# EasyEDA schematic SCH.json
TITLE: Project Sentinel; REV: 1.0; Date: 2025-03-24; Sheet: 1/1; Drawn By: Napat Minual; Company: Vetra, Manta Ray
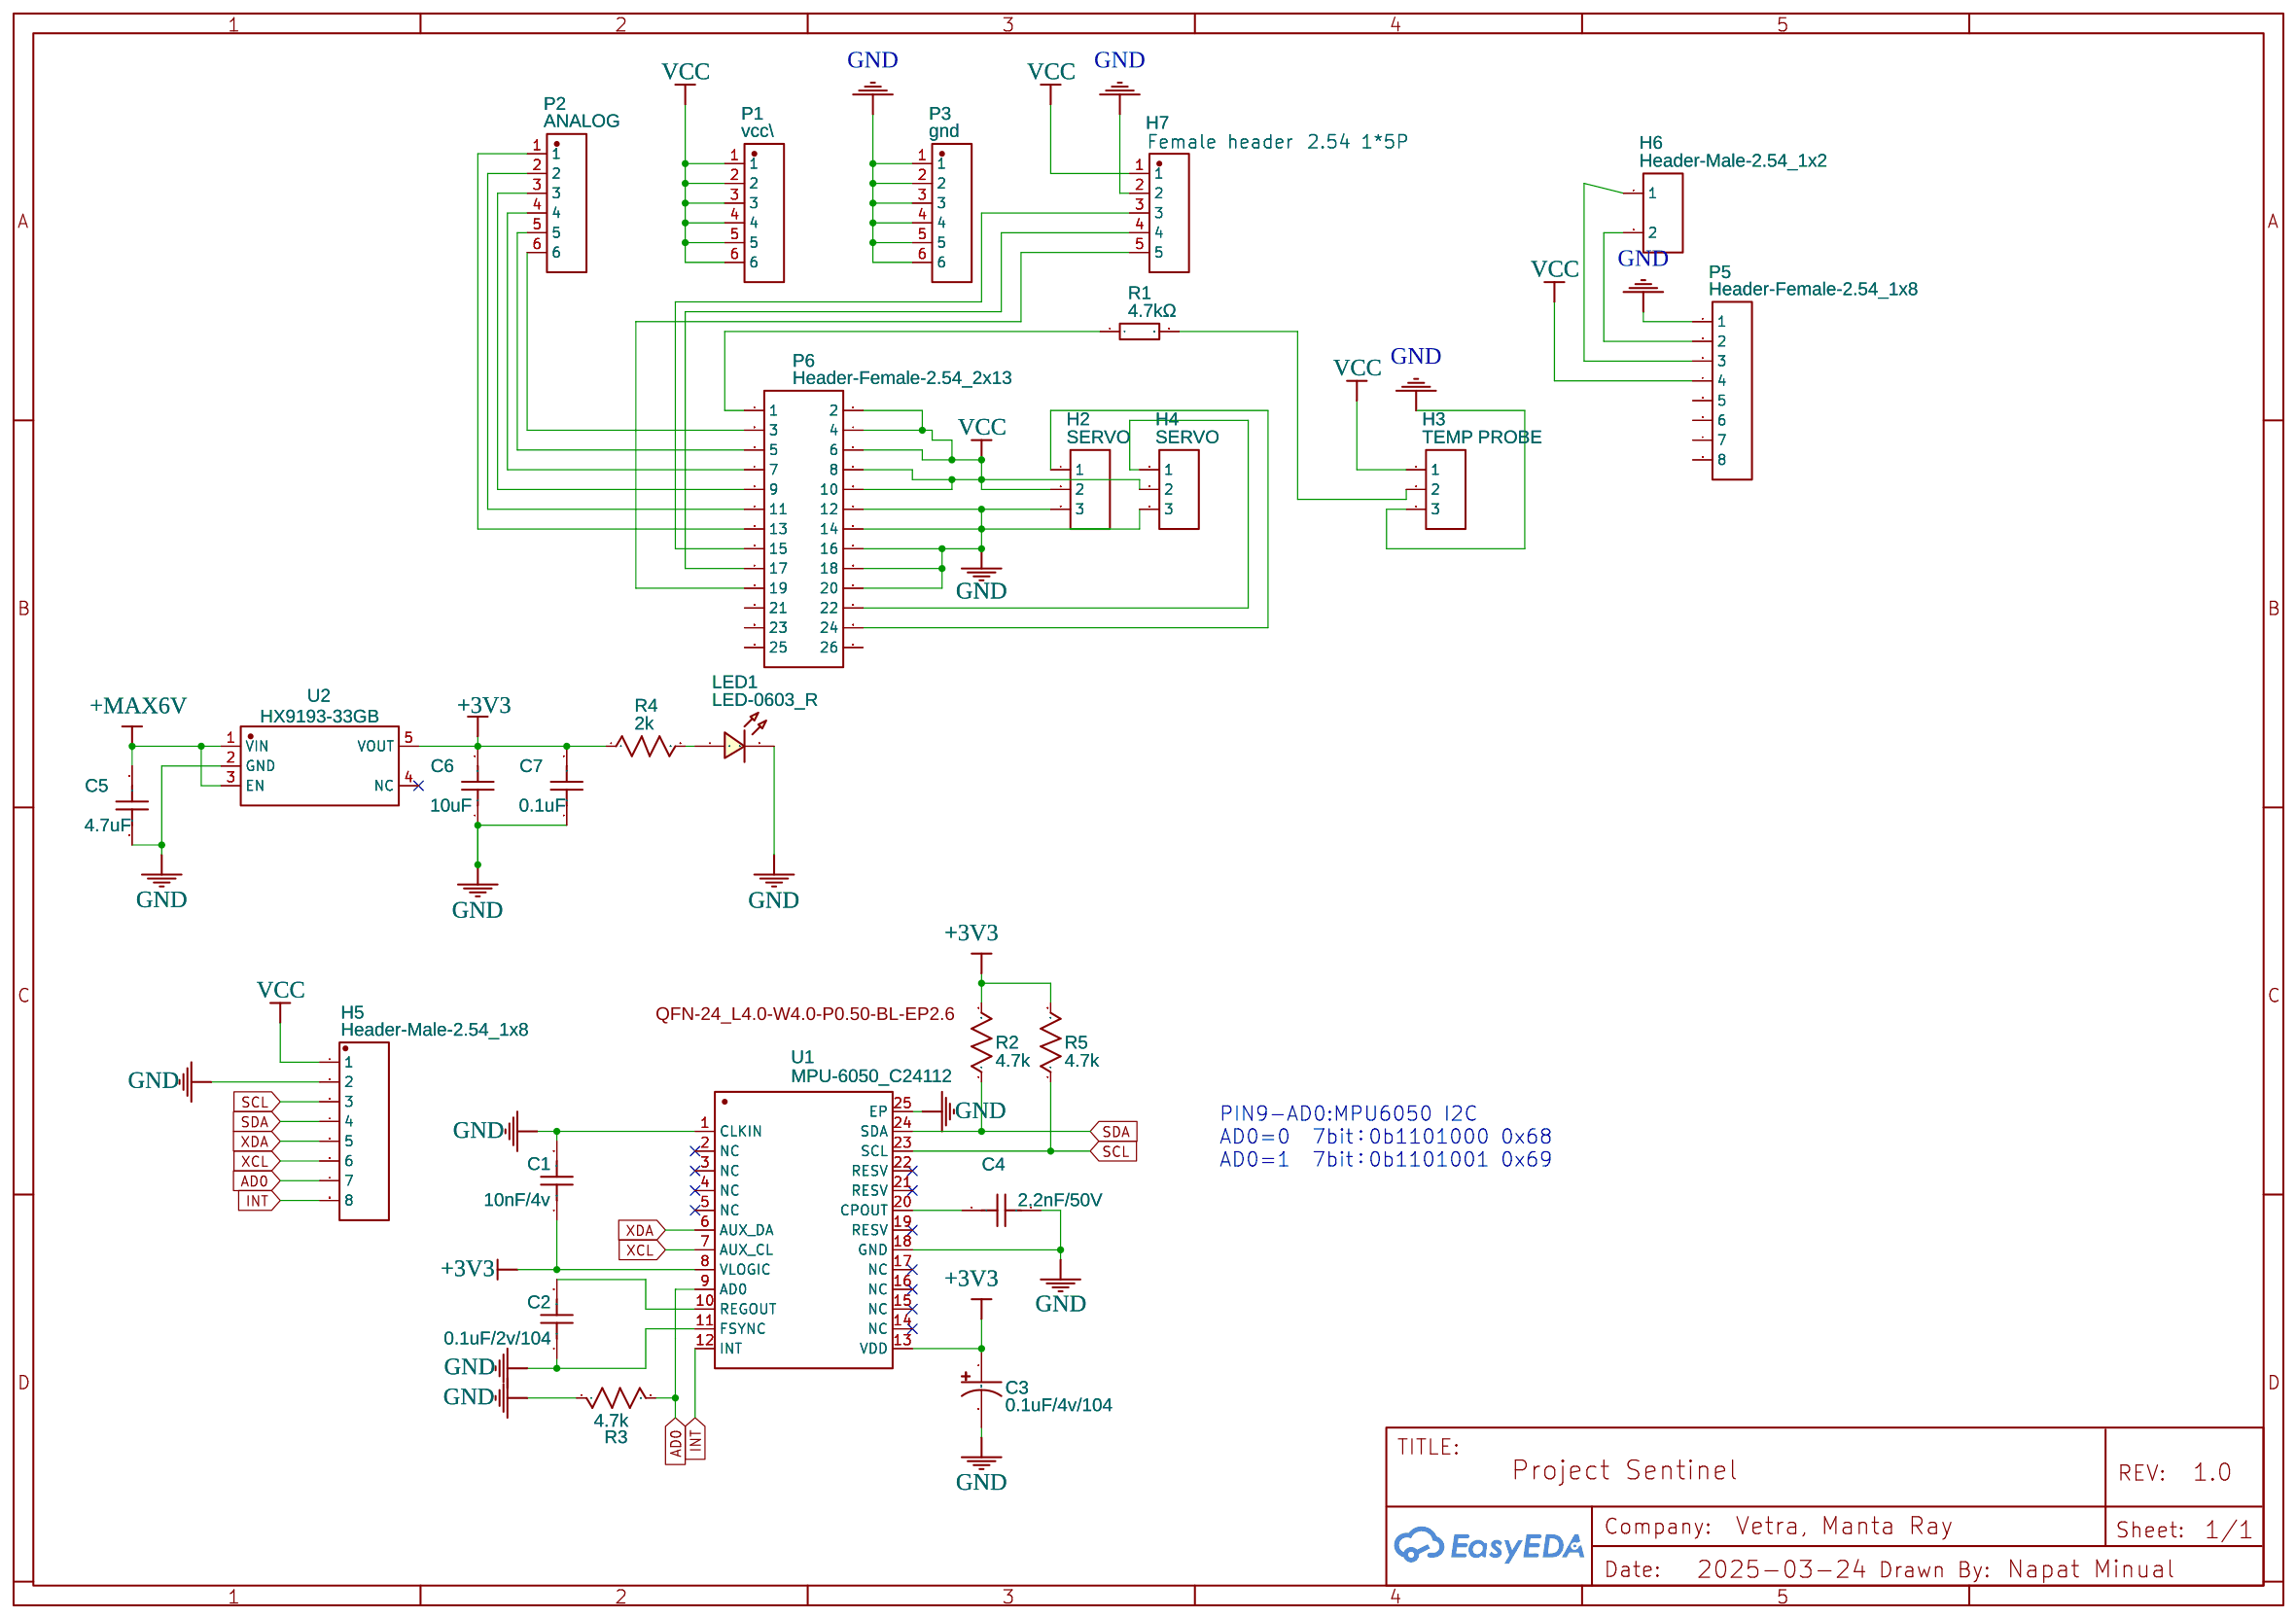
[diagram p0: schematic sheet]

## Parts
C1  10nF/4v  [C0402]
C2  0.1uF/2v/104  [C0402]
C3  0.1uF/4v/104  [CAP-SMD_L3.2-W1.6]
C4  2.2nF/50V  [C0402]
C5  4.7uF  [C0402]
C6  10uF  [C0402]
C7  0.1uF  [C0402]
H2  SERVO  [HDR-TH_3P-P2.54-V-M-1]
H3  TEMP PROBE  [HDR-TH_3P-P2.54-V-M-1]
H4  SERVO  [HDR-TH_3P-P2.54-V-M-1]
H5  Header-Male-2.54_1x8  [HDR-TH_8P-P2.54-V-M]
H6  Header-Male-2.54_1x2  [HDR-TH_2P-P2.54-V-M-1]
H7  Female header　2.54 1*5Ｐ  [HDR-TH_5P-P2.54-V-F-B]
LED1  LED-0603_R  [LED0603_RED]
P1  vcc\  [HDR-TH_6P-P2.54-V-F]
P2  ANALOG  [HDR-TH_6P-P2.54-V-F]
P3  gnd  [HDR-TH_6P-P2.54-V-F]
P5  Header-Female-2.54_1x8  [HDR-TH_8P-P2.54-V-F-1]
P6  Header-Female-2.54_2x13  [HDR-TH_26P-P2.54-V-F-R2-C13-S2.54-1]
R1  4.7kΩ  [R2010]
R2  4.7k  [C0402]
R3  4.7k  [C0402]
R4  2k  [C0402]
R5  4.7k  [C0402]
U1  MPU-6050_C24112  [QFN-24_L4.0-W4.0-P0.50-BL-EP2.6]
U2  HX9193-33GB  [SOT-23-5_L3.0-W1.7-P0.95-LS2.8-BR]

## Library data of the parts
C1 C2 C4-C7 = C_0603_US: Contributor: LCEDA_Lib
C3 = TPSA106K016R1000_C282116: Supplier: LCSC; Supplier Part: C282116; Manufacturer: AVX; Manufacturer Part: TPSA106K016R1000; Contributor: LCSC
H2-H4 = Header-Male-2.54_1x3: Supplier: LCSC; Manufacturer: BOOMELE(博穆精密); Manufacturer Part: 2.54-1*3P针; Supplier Part: C49257; JLCPCB Part Class: Extended Part
H5 = Header-Male-2.54_1x8: Contributor: LCSC; Supplier: LCSC; Manufacturer: Ckmtw(灿科盟); Manufacturer Part: B-2100S08P-A110; Supplier Part: C124381; JLCPCB Part Class: Extended Part
H6 = Header-Male-2.54_1x2: Supplier: LCSC; Manufacturer: TE Connectivity(泰科电子); Manufacturer Part: 826629-2; Supplier Part: C86471; JLCPCB Part Class: Extended Part
H7 = Female header　2.54 1*5Ｐ: Supplier Part: C46341; Supplier: LCSC; Manufacturer: null; Manufacturer Part: 排母　2.54 1*5Ｐ; JLCPCB Part Class: Extended Part
LED1 = LED-0603_R: Manufacturer: EVERLIGHT(台湾亿光); Manufacturer Part: 19-217/R6C-AL1M2VY/3T; Supplier Part: C72044; Supplier: LCSC; Contributor: LCEDA_01
P1-P3 = Header-Female-2.54_1x6: Supplier: LCSC; Manufacturer: BOOMELE(博穆精密); Manufacturer Part: 2.54-1*6P母; Supplier Part: C40877; JLCPCB Part Class: Extended Part
P5 = Header-Female-2.54_1x8: Supplier: LCSC; Manufacturer: BOOMELE(博穆精密); Manufacturer Part: 2.54-1*8P母环保; Supplier Part: C27438; JLCPCB Part Class: Extended Part
P6 = Header-Female-2.54_2x13: Supplier: LCSC; Manufacturer: BOOMELE(博穆精密); Manufacturer Part: 2.54-2*13P母; Supplier Part: C64320; JLCPCB Part Class: Extended Part
R1 = RMC20104.7K1%N: Contributor: LCSC; Supplier: LCSC; Supplier Part: C269341; Manufacturer: Tyohm(幸亚电阻); JLCPCB Part Class: Extended Part
R2-R5 = R_0603_US: Contributor: LCEDA_Lib
U1 = MPU-6050_C24112: sourceId: 1T5FDZYC8; Supplier: LCSC; Manufacturer: InvenSense; Manufacturer Part: MPU-6050; LCSC Assembly: Yes; image: //image.lceda.cn/szlcsc/C24112.jpg; Supplier Part: C24112; SMT Type: Basic; Package Display: Yes
U2 = HX9193-33GB: Supplier: LCSC; Supplier Part: C296123; Manufacturer: hengjiaxing; Contributor: LCSC; LCSC Assembly: Yes; SMT Type: Extend

## Nets
+3V3: C1.1 C3.1 C6.2 C7.2 R2.2 R4.1 R5.2 U1.8(VLOGIC) U1.13(VDD) U2.5(VOUT)
GND: C1.2 C2.1 C3.2 C4.1 C5.1 C6.1 C7.1 H2.3 H3.3 H4.3 H5.2 H7.2 LED1.2 P3.1 P3.2 P3.3 P3.4 P3.5 P3.6 P5.1 P6.12 P6.14 P6.16 P6.18 P6.20 R3.1 U1.1(CLKIN) U1.11(FSYNC) U1.18(GND) U1.25(EP) U2.2(GND)
VCC: H2.2 H3.1 H4.2 H5.1 H7.1 P1.1 P1.2 P1.3 P1.4 P1.5 P1.6 P5.4 P6.2 P6.4 P6.6 P6.8 P6.10
+MAX6V: C5.2 U2.1(VIN) U2.3(EN)
AD0: H5.7 R3.2 U1.9(AD0)
INT: H5.8 U1.12(INT)
SCL: H5.3 R5.1 U1.23(SCL)
SDA: H5.4 R2.1 U1.24(SDA)
XCL: H5.6 U1.7(AUX_CL)
XDA: H5.5 U1.6(AUX_DA)
Net-(C2-2): C2.2 U1.10(REGOUT)
Net-(C4-2): C4.2 U1.20(CPOUT)
Net-(H2-1): H2.1 P6.24
Net-(H3-2): H3.2 R1.2
Net-(H4-1): H4.1 P6.22
Net-(H6-1): H6.1 P5.3
Net-(H6-2): H6.2 P5.2
Net-(H7-3): H7.3 P6.15
Net-(H7-4): H7.4 P6.17
Net-(H7-5): H7.5 P6.19
Net-(LED1-1): LED1.1 R4.2
Net-(P2-1): P2.1 P6.13
Net-(P2-2): P2.2 P6.11
Net-(P2-3): P2.3 P6.9
Net-(P2-4): P2.4 P6.7
Net-(P2-5): P2.5 P6.5
Net-(P2-6): P2.6 P6.3
Net-(P6-1): P6.1 R1.1

Not connected (* = marked no-connect by the designer): P5 5 6 7 8; P6 21 23 25 26; U1 2(NC)* 3(NC)* 4(NC)* 5(NC)* 14(NC)* 15(NC)* 16(NC)* 17(NC)* 19(RESV)* 21(RESV)* 22(RESV)*; U2 4(NC)*

## Notes on the sheet
- PIN9-AD0:MPU6050 I2C
  AD0=0  7bit：0b1101000 0x68
  AD0=1  7bit：0b1101001 0x69
